# Altium project VISION Control Board.PrjPcb
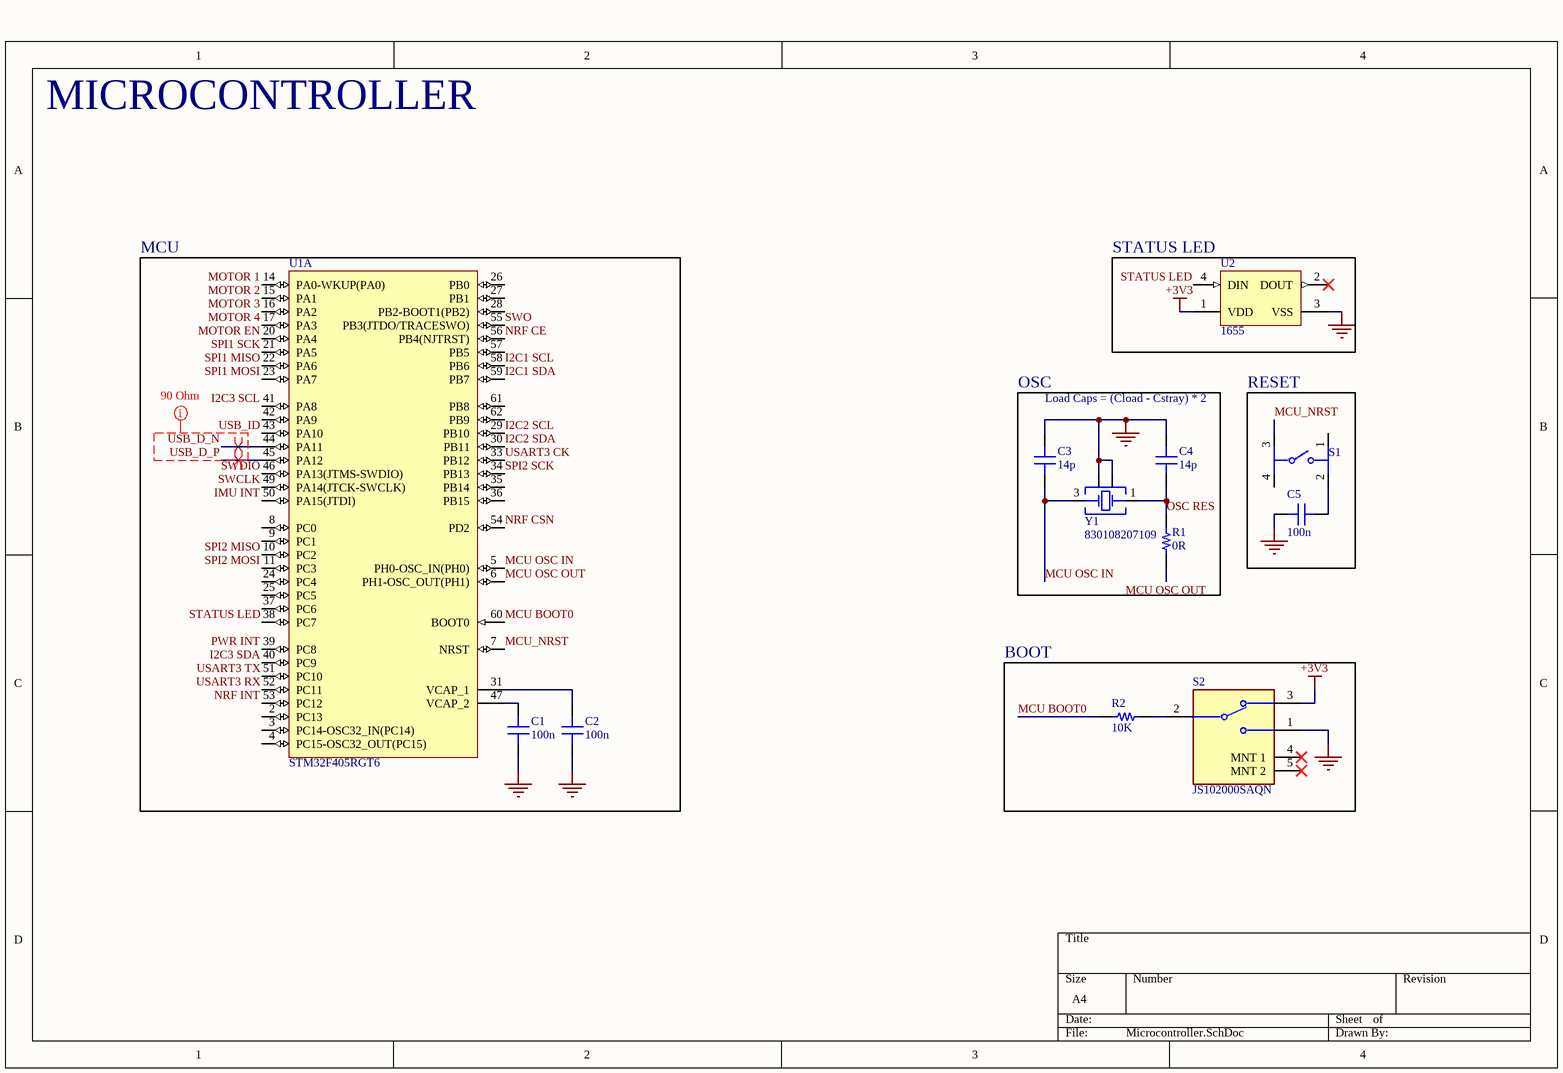
[diagram p0: Microcontroller.SchDoc]
2 sheets, 21 parts. Net scope: global (net labels, ports and power ports of the same name join across sheets).
Board file: PCB.PcbDoc
Sheets:
  Microcontroller.SchDoc
  Sensors.SchDoc

## Sheet Microcontroller.SchDoc
size A4; SheetNumber: 1; SheetTotal: 7

### Parts
C1  100n  [CAP 0402_1005]
C2  100n  [CAP 0402_1005]
C3  14p  [CAP 0402_1005]
C4  14p  [CAP 0402_1005]
C5  100n  [CAP 0402_1005]
R1  0R  [RES 0402_1005]
R2  10K  [RES 0402_1005]
S1  PTS645SM43SMTR92LFS  [FP-PTS645SM43SMTR92LFS-MFG]  (value not drawn)
S2  JS102000SAQN  [FP-JS102000SAQN-MFG]
U1  STM32F405RGT6  [STM-LQFP64_M]  (part A of 2)
U2  1655  [ADA-RGB-1655_V]
Y1  830108207109  [WE-XTAL_CFPX-180]

### Blocks framed on the sheet
MCU: C1 C2 U1
STATUS LED: U2
OSC: C3 C4 R1 Y1
RESET: C5 S1
BOOT: R2 S2

### Nets
+3V3: S2.3 U2.1(VDD)
GND: C1.1 C2.1 C3.2 C4.2 C5.2 S2.1 U2.3(VSS) Y1.2(GND&Lid) Y1.4(GND&Lid)
I2C1 SCL: U1.58(PB6)
I2C1 SDA: U1.59(PB7)
I2C2 SCL: U1.29(PB10)
I2C2 SDA: U1.30(PB11)
I2C3 SCL: U1.41(PA8)
I2C3 SDA: U1.40(PC9)
IMU INT: U1.50(PA15(JTDI))
MCU BOOT0: R2.1 U1.60(BOOT0)
MCU OSC IN: C3.1 U1.5(PH0-OSC_IN(PH0)) Y1.3(Crystal)
MCU OSC OUT: R1.1 U1.6(PH1-OSC_OUT(PH1))
MCU_NRST: S1.3 U1.7(NRST)
MOTOR 1: U1.14(PA0-WKUP(PA0))
MOTOR 2: U1.15(PA1)
MOTOR 3: U1.16(PA2)
MOTOR 4: U1.17(PA3)
MOTOR EN: U1.20(PA4)
NRF CE: U1.56(PB4(NJTRST))
NRF CSN: U1.54(PD2)
NRF INT: U1.53(PC12)
OSC RES: C4.1 R1.2 Y1.1(Crystal)
PWR INT: U1.39(PC8)
SPI1 MISO: U1.22(PA6)
SPI1 MOSI: U1.23(PA7)
SPI1 SCK: U1.21(PA5)
SPI2 MISO: U1.10(PC2)
SPI2 MOSI: U1.11(PC3)
SPI2 SCK: U1.34(PB13)
STATUS LED: U1.38(PC7) U2.4(DIN)
SWCLK: U1.49(PA14(JTCK-SWCLK))
SWDIO: U1.46(PA13(JTMS-SWDIO))
SWO: U1.55(PB3(JTDO/TRACESWO))
USART3 CK: U1.33(PB12)
USART3 RX: U1.52(PC11)
USART3 TX: U1.51(PC10)
USB_D_N: U1.44(PA11)
USB_D_P: U1.45(PA12)
USB_ID: U1.43(PA10)
NetC1_2: C1.2 U1.47(VCAP_2)
NetC2_2: C2.2 U1.31(VCAP_1)
NetC5_1: C5.1 S1.2
NetR2_2: R2.2 S2.2(C)

Not connected (* = marked no-connect by the designer): S1 1 4; S2 4(MNT_1)* 5(MNT_2)*; U1 2(PC13) 3(PC14-OSC32_IN(PC14)) 4(PC15-OSC32_OUT(PC15)) 8(PC0) 9(PC1) 24(PC4) 25(PC5) 26(PB0) 27(PB1) 28(PB2-BOOT1(PB2)) 35(PB14) 36(PB15) 37(PC6) 42(PA9) 57(PB5) 61(PB8) 62(PB9); U2 2(DOUT)*

### Layout directives
differential pair: USB_D_N, USB_D_P
net class 90 Ohm: USB_D_N, USB_D_P

### Notes on the sheet
- MICROCONTROLLER
- Load Caps = (Cload - Cstray) * 2

### Library data of the parts
C1 C2 = CL05B104KP5VPNC: CAP CER 100NF 10V X7R 0402; manufacturer: Samsung Electro-Mechanics; Capacitance: 0.1 µF; Tolerance: ±10%; Part Number: CL05B104KP5VPNC; Value: 100n; Applications: Automotive; componentlink1description: Datasheet; componentlink1url: https://mm.digikey.com/Volume0/opasdata/d220001/medias/docus/5458/CL05B104KP5VPNC_Spec.pdf; componentlink2description: DigiKey Link; componentlink2url: https://www.digikey.com/en/products/detail/samsung-electro-mechanics/CL05B104KP5VPNC/20498482; Device Package: 0402 (1005 Metric); lastupdated: 29/01/2024 8:03:07 PM; Lifecycle Status: Active; Minimum Order: 1; Mounting Type: Surface Mount, MLCC; Operating Temperature: -55°C ~ 125°C; Package / Case: 0402 (1005 Metric); packaging: TapeAndReel; partid: 56690; price: 0.01; Ratings: AEC-Q200; series: CL; Size / Dimension: 0.039" L x 0.020" W (1.00mm x 0.50mm); Supplier 1: DigiKey; Supplier Part Number 1: 1276-CL05B104KP5VPNCCT-ND; Temperature Coefficient: X7R; Thickness (Max): 0.022" (0.55mm); Voltage - Rated: 10V
C3 C4 = GJM1555C1H140GB01D: CAP CER 14PF 50V C0G/NP0 0402; Part Number: GJM1555C1H140GB01D
C5 = CL05B104KP5VPNC: CAP CER 100NF 10V X7R 0402; Part Number: CL05B104KP5VPNC
R1 = 5112: 0402 JUMPER ON TAPE AND REEL; Part Number: 5112
R2 = RP73PF1E10KBTD: RES 10K OHM 0.1% 1/10W 0402; Part Number: RP73PF1E10KBTD
S1 = CMP-2000-05160-2: SWITCH TACTILE SPST-NO 0.05A 12V; Contact Resistance: 100mR; Throw Configuration: SPST; Illumination Type: Non-Illuminated; Mechanical Life: 100000Cycles; Current Rating: 50mA; Switch Function: Off-Mom; Actuator Length: 0.85mm; Actuator Material: Nylon; Actuator Type: Standard; Operating Force: 160gf; Min Operating Temperature: -20°C; REACH SVHC: No SVHC; Termination: Gull Wing; Case/Package: SMD/SMT; Packaging: Tape and Reel; Mount: Surface Mount; Voltage Rating (DC): 12V; Orientation: Straight; Lead Free: Lead Free; Contact Material: Silver; Color: Black; Max Current Rating: 50mA; Contact Plating: Silver; Depth: 9mm; Package Quantity: 1; Max Voltage Rating (DC): 12V; Length: 6mm; Max Operating Temperature: 60°C
S2 = CMP-10038-000025-1: SWITCH SLIDE SPDT 1MA 5V; Actuator Material: Nylon; Contact Resistance: 70mR; Electrical Life: 15000Cycles; Actuator Length: 1.5mm; Switch Function: On-On; Actuator Type: Standard; Actuator Color: Black; Current Rating: 1mA; Throw Configuration: SPDT; Termination: Gull Wing; Housing Material: Nylon; Max Operating Temperature: 85°C; Max Voltage Rating (DC): 5V; Voltage Rating (DC): 5V; Contact Plating: Silver; Radiation Hardening: No; Package Quantity: 1; REACH SVHC: No SVHC; RoHS Compliant: Yes; Orientation: Right Angle; Max Current Rating: 1mA; Case/Package: SMD/SMT; Contact Current Rating: 1mA; Contact Material: Copper Alloy; Mount: Surface Mount; Flammability Rating: UL94 V-2; Packaging: Tape and Reel; Switch Travel: 1.5mm; Length: 7.8mm; Series: JS; Min Operating Temperature: -20°C; Depth: 4.82mm
U1 = CMP-0243-00019-3: ARM Cortex-M4 32-bit MCU+FPU, 210 DMIPS, 1024 kB Flash, 192 kB Internal RAM, 51 I/Os, 64-pin LQFP, -40 to 85 degC, Tray; Manufacturer: STMicroelectronics; Supply Voltage(Vcc) min (V): 1.8; Supply Voltage(Vcc) max (V): 3.6; Internal RAM Size (kB): 192; I/Os (High Current): 51; D/A Converter: 2x12-bit; FLASH Size (Prog) (kB): 1024; Operating Frequency(F) (Processor speed) (MHz): 168; ComponentLink2Description: Datasheet; PackageVersion: Rev. 4, 06/2013; DatasheetVersion: Rev. 4; Core: ARM Cortex-M4; ComponentLink2URL: http://www.st.com/st-web-ui/static/active/en/resource/technical/document/datasheet/DM00037051.pdf; PackageReference: LQFP64; Packing: Tray; ComponentLink1Description: Manufacturer URL; ComponentLink3URL: http://www.st.com/st-web-ui/static/active/en/resource/technical/document/datasheet/DM00037051.pdf; ComponentLink3Description: Package Specification; Mounting Technology: Surface Mount; ComponentLink1URL: http://www.st.com/web/en/home.html; PackageDescription: 64-Pin Low Profile Quad Flat Package, 10 x 10 mm Body, 0.5 mm Pitch; PartNumber: STM32F405RGT6
U2 = CMP-2000-05026-1: Intelligent Control LED Integrated Light Source, 3.5 to 5.3 V, -25 to 80 degC, 4-Pin SMD, RoHS, Tape and Reel; Manufacturer: Adafruit-Industries-LLC; Number of LEDs: 10; Configuration: Discrete; Utilized LED: WS2812(5050); Datasheet URL: http://datasheet.octopart.com/ADA1655-Adafruit-Industries-datasheet-32028139.pdf; Series: Neopixel; Interface: -; Package Description: 4-Pin Surface Mount Device, Body 5 x 5 mm; Color: Red,Green,Blue(RGB); Category: Optoelectronics; Controller Type: -; Package Reference: 1655; Manufacturer URL: https://www.adafruit.com/; Mounting Type: SurfaceMount; Datasheet Version: May-13; Size / Dimension: 5.00mmLx5.00mmW; Family: Addressable,Specialty
Y1 = CMP-03913-116855757-1: 830108207109 WE-XTAL Quartz Crystal; Frequency: 16MHz; Width: 2.5mm; Max Operating Temperature: 85°C; Height: 800µm; NexarPartId: 116855757; Min Operating Temperature: -40°C; Length: 3.2mm

## Sheet Sensors.SchDoc
size A4; SheetNumber: 3; SheetTotal: 7
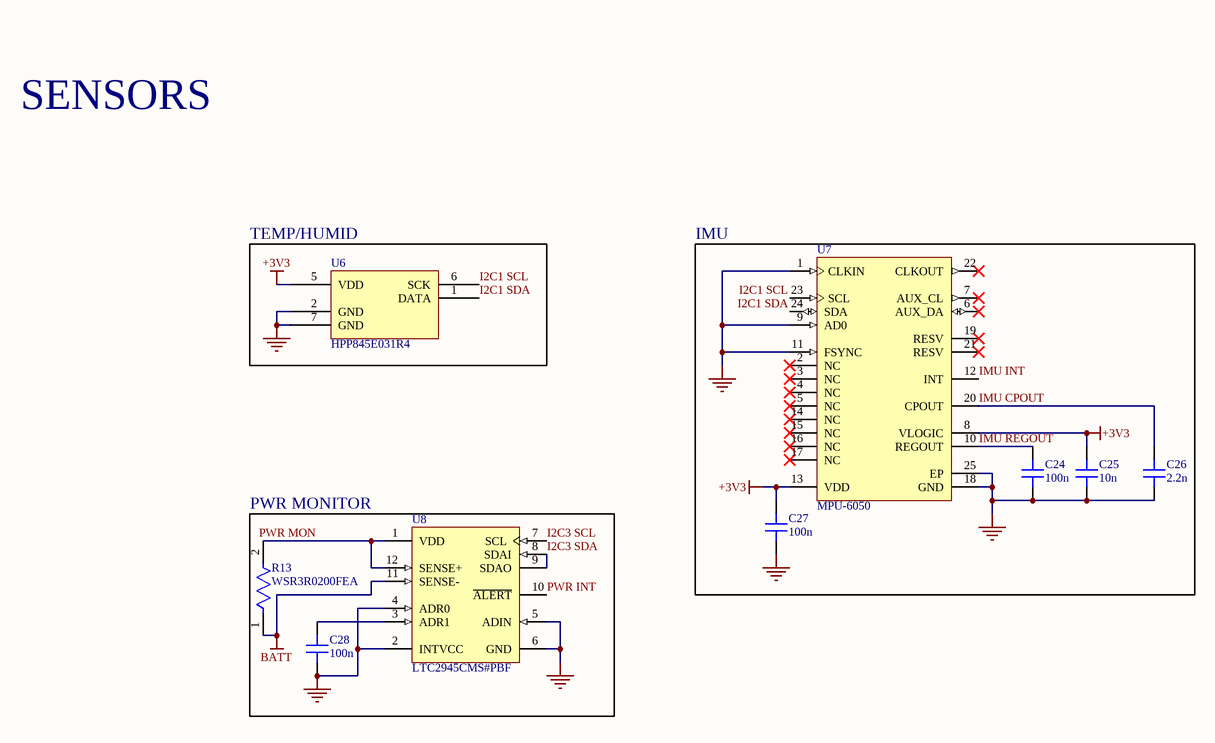
[diagram p1: Sensors.SchDoc]

### Parts
C24  100n  [CAP 0402_1005]
C25  10n  [CAP 0402_1005]
C26  2.2n  [CAP 0402_1005]
C27  100n  [CAP 0402_1005]
C28  100n  [CAP 0402_1005]
R13  WSR3R0200FEA  [FP-WSR3-MFG]
U6  HPP845E031R4  [TE HPP845E031R4]
U7  MPU-6050  [IS-QFN-24_V]
U8  LTC2945CMS#PBF  [LT-MS-12_M]

### Blocks framed on the sheet
TEMP/HUMID: U6
IMU: C24-C27 U7
PWR MONITOR: C28 R13 U8

### Nets
+3V3: C25.2 C27.2 U6.5(VDD) U7.8(VLOGIC) U7.13(VDD)
BATT: R13.1 U8.11(SENSE-)
GND: C24.1 C25.1 C26.1 C27.1 C28.1 U6.2(GND) U6.7(GND) U7.1(CLKIN) U7.9(AD0) U7.11(FSYNC) U7.18(GND) U7.25(EP) U8.2(INTVCC) U8.4(ADR0) U8.5(ADIN) U8.6(GND)
I2C1 SCL: U6.6(SCK) U7.23(SCL)
I2C1 SDA: U6.1(DATA) U7.24(SDA)
I2C3 SCL: U8.7(SCL)
I2C3 SDA: U8.8(SDAI) U8.9(SDAO)
IMU CPOUT: C26.2 U7.20(CPOUT)
IMU INT: U7.12(INT)
IMU REGOUT: C24.2 U7.10(REGOUT)
PWR INT: U8.10(~{ALERT})
PWR MON: R13.2 U8.1(VDD) U8.12(SENSE+)
NetC28_2: C28.2 U8.3(ADR1)

Not connected (* = marked no-connect by the designer): U7 2(NC)* 3(NC)* 4(NC)* 5(NC)* 6(AUX_DA)* 7(AUX_CL)* 14(NC)* 15(NC)* 16(NC)* 17(NC)* 19(RESV)* 21(RESV)* 22(CLKOUT)*

### Notes on the sheet
- SENSORS

### Library data of the parts
C24 C27 C28 = CL05B104KP5VPNC: CAP CER 100NF 10V X7R 0402; Part Number: CL05B104KP5VPNC
C25 = C0402C103J5RECAUTO: CAP CER 0402 10NF 50V X7R 5%; Part Number: C0402C103J5RECAUTO
C26 = C0402C222J3GEC7867: CAP CER 0402 2.2NF 25V C0G 5%; Part Number: C0402C222J3GEC7867
R13 = CMP-00030-39853526-1: WSR3R0200FEA Res Metal Strip 4527 0.02 Ohm 1% 3W ±75ppm/°C Molded SMD SMD Embossed Plastic T/R; Resistance: 20mΩ; Voltage Rating (DC): 240mV; Features: Automotive AEC-Q200, Moisture Resistant; Tolerance: 1%; Radiation Hardening: No; Composition: Metal Element; Width: 6.98mm; Min Operating Temperature: -65°C; Case Code (Imperial): 4527; Schedule B: 8533210045, 8533210045; Height: 2.41mm; Max Power Dissipation: 3W; Military Standard: Not; Contact Plating: Silver, Tin; Lead Free: Lead Free; Power Rating: 3W; Case/Package: 4527; RoHS: Compliant; REACH SVHC: No SVHC; Depth: 6.98mm; Number of Terminations: 2; Temperature Coefficient: 75ppm/°C; NexarPartId: 39853526; Packaging: Cut Tape; Length: 11.56mm; Termination: SMD/SMT; Max Operating Temperature: 275°C
U6 = HPP845E031R4: SENSOR HUMID/TEMP 3V I2C 2% SMD; Part Number: HPP845E031R4
U7 = CMP-1753-00002-2: 3-Axis Gyroscope, Accelerometer and a Digital Motion Processor(TM) (DMP), 2.375 to 3.46 V, -40 to 85 degC, 24-Pin QFN, RoHS, Tape and Reel; Manufacturer: InvenSense; Featured Product: MPU-60506-Axis,IntegratedI²CSolution; Other Names: 1428-1007-2 / MPU6050; Sensor Type: MotionTracking; Online Catalog: MPU-6000™Series; Unit PriceUSD: Digital; Datasheet Version: Rev. 3.3, 05/2012; Category: Sensors,Transducers; Datasheet URL: http://datasheet.octopart.com/MPU-6050-InvenSense-datasheet-14421344.pdf; Family: Multifunction; Standard Package: 5,000; Manufacturer URL: http://www.invensense.com/; Output Type: Digital; Dynamic Catalog: MPU-6000™Series
U8 = CMP-0482-00795-1: Wide Range I2C Power Monitor, 12-pin SOP (MS-12), 0 to 70 degC, Pb-Free; Manufacturer: Linear Technology; Number of Supplies(#): 1; ComponentLink3Description: Package Specification; PackageDescription: 12-Pin Plastic MSOP, Body 4.039 x 3 mm, Pitch 0.65 mm; RoHS: TRUE; ComponentLink1URL: http://www.linear.com/; ComponentLink2Description: Datasheet; PackageVersion: Rev. A, 05/2013; PackageReference: MS-12; ComponentLink3URL: http://cds.linear.com/docs/en/packaging/05081668_A_MS12.pdf; PartNumber: LTC2945CMS#PBF; ComponentLink1Description: Manufacturer URL; ComponentLink2URL: http://cds.linear.com/docs/en/datasheet/2945f.pdf; Mounting Technology: Surface Mount

## Nets that join several sheets
+3V3: Microcontroller (S2.3 U2.1), Sensors (5 pins)
GND: Microcontroller (9 pins), Sensors (16 pins)
I2C1 SCL: Microcontroller (U1.58), Sensors (U6.6 U7.23)
I2C1 SDA: Microcontroller (U1.59), Sensors (U6.1 U7.24)
I2C3 SCL: Microcontroller (U1.41), Sensors (U8.7)
I2C3 SDA: Microcontroller (U1.40), Sensors (U8.8 U8.9)
IMU INT: Microcontroller (U1.50), Sensors (U7.12)
PWR INT: Microcontroller (U1.39), Sensors (U8.10)